# EAGLE design tokyo (EAGLE 7.6.0)
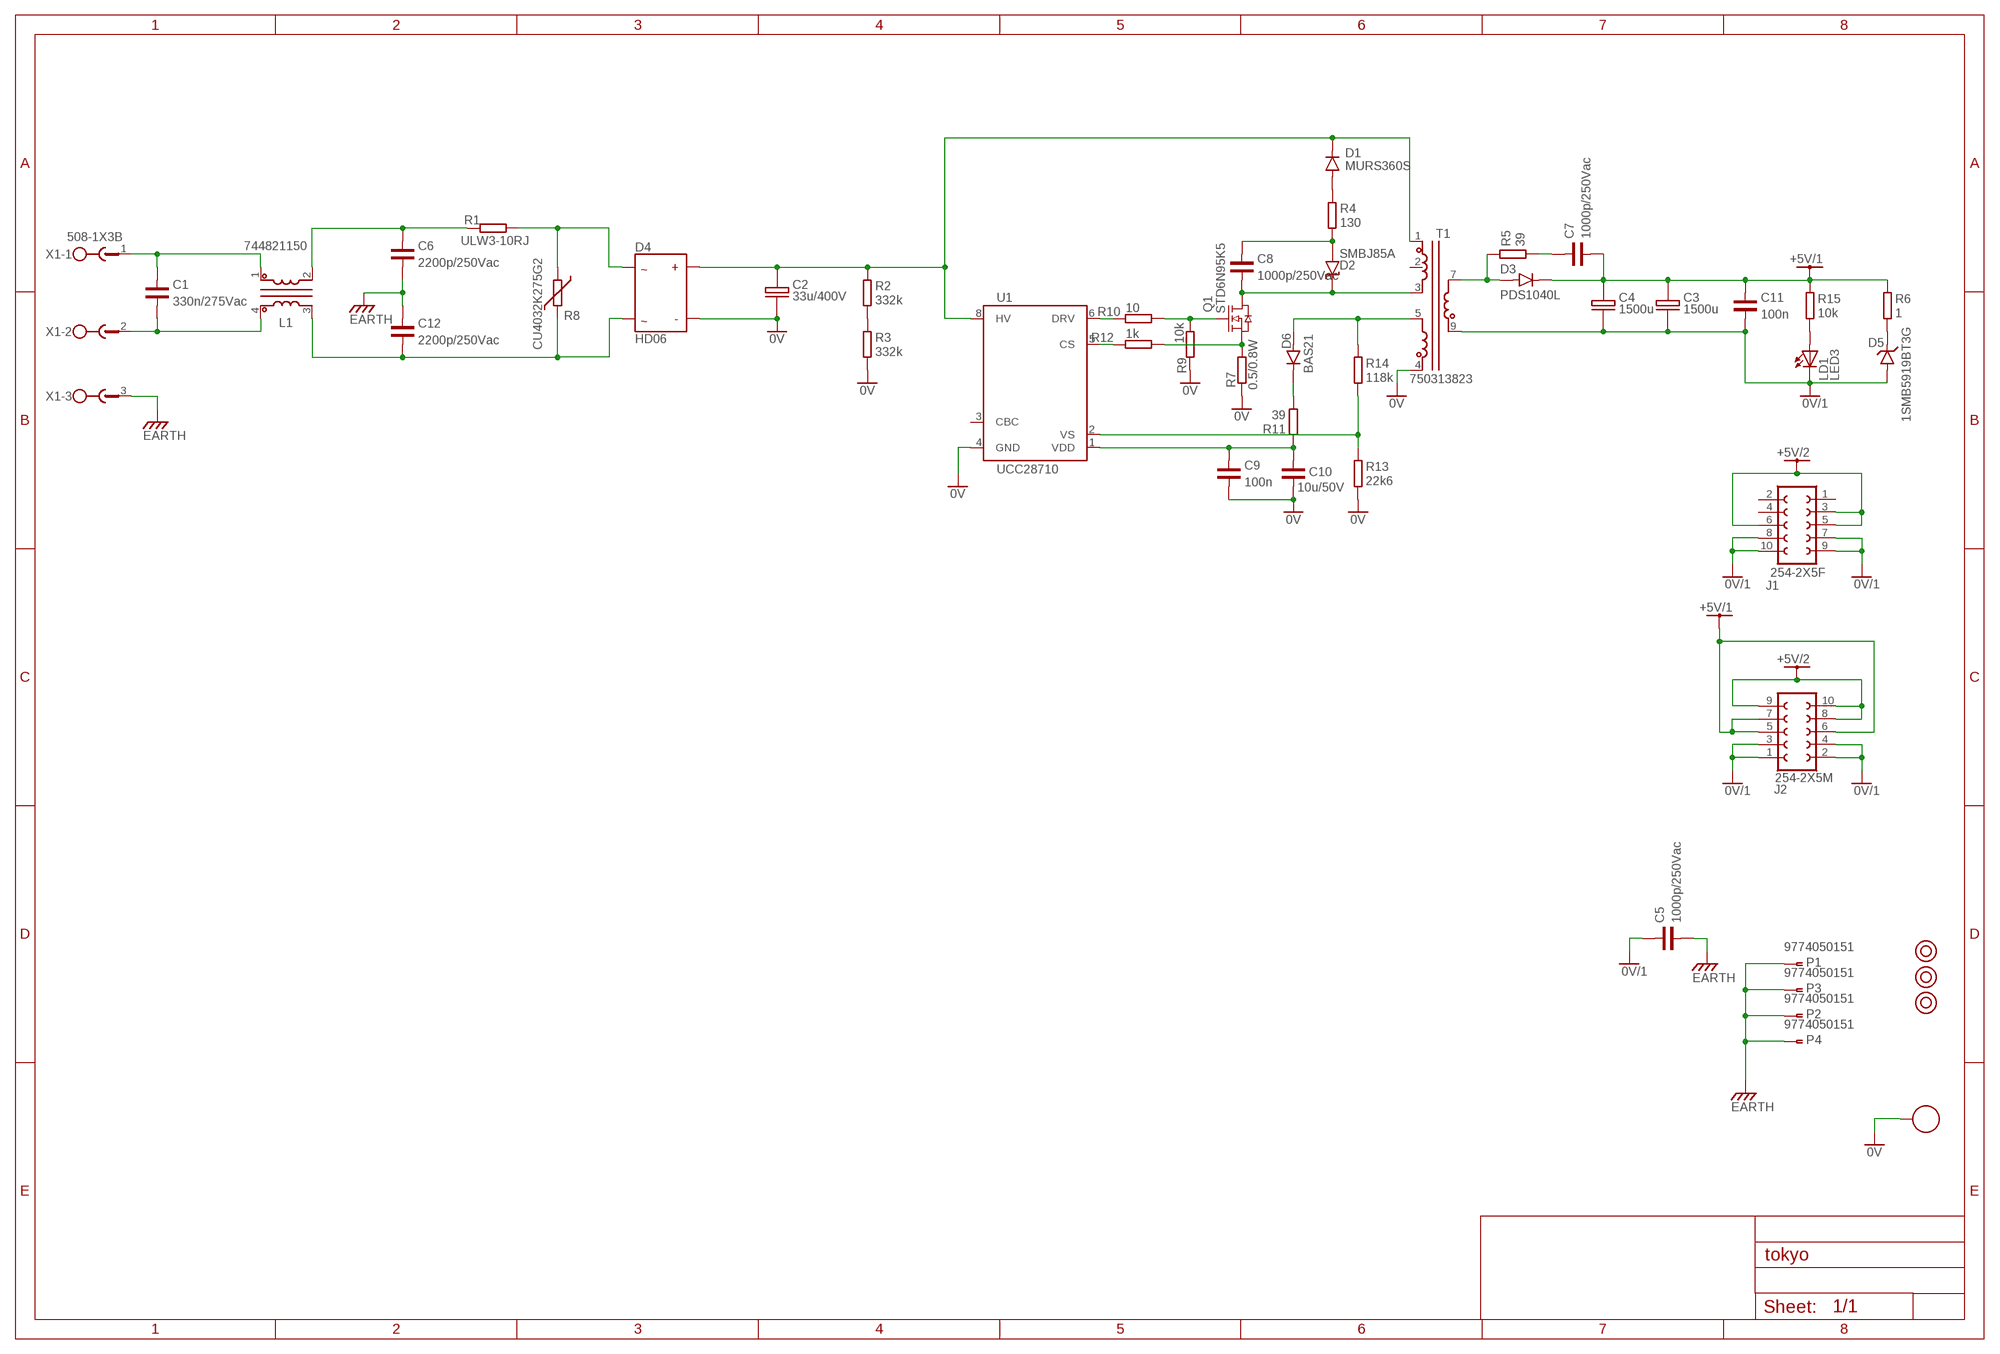
[diagram p0: schematic, sheet 1]

## Parts
0V  TESTPOINT  [TESTPOINT]
C1  330n/275Vac  C15X8.5  [15X8.5]
C2  33u/400V  C+D18  [D18]
C3  1500u  C+D10  [D10]
C4  1500u  C+D10  [D10]
C5  1000p/250Vac  C1812  [1812]
C6  2200p/250Vac  C2211  [2211]
C7  1000p/250Vac  C1812  [1812]
C8  1000p/250Vac  C1812  [1812]
C9  100n  C0603  [0603]
C10  10u/50V  C1206  [1206]
C11  100n  C0603  [0603]
C12  2200p/250Vac  C2211  [2211]
D1  MURS360S  [DO-214AA]
D2  SMBJ85A  [DO-214AA]
D3  PDS1040L  [POWERDI5]
D4  HD06  [MINIDIP]
D5  1SMB5919BT3G  [DO-214AA]
D6  BAS21  [SOT23]
FIDUCIAL1  FIDUCIAL  [FIDUCIAL]
FIDUCIAL2  FIDUCIAL  [FIDUCIAL]
FIDUCIAL3  FIDUCIAL  [FIDUCIAL]
J1  254-2X5F  [254-2X5F]
J2  254-2X5M  [254-2X5M]
L1  744821150  [744821150]
LD1  LED3  [LED3]
P1  9774050151  [9774050151]
P2  9774050151  [9774050151]
P3  9774050151  [9774050151]
P4  9774050151  [9774050151]
Q1  STD6N95K5  [DPAK]
R1  ULW3-10RJ  R15X6  [15X6]
R2  332k  R1206  [1206]
R3  332k  R1206  [1206]
R4  130  R1206  [1206]
R5  39  R1206  [1206]
R6  1  R1206  [1206]
R7  0.5/0.8W  R2512  [2512]
R8  CU4032K275G2  [4032]
R9  10k  R0603  [0603]
R10  10  R0603  [0603]
R11  39  R0603  [0603]
R12  1k  R0603  [0603]
R13  22k6  R0603  [0603]
R14  118k  R0603  [0603]
R15  10k  R0603  [0603]
T1  750313823  [EE16]
U1  UCC28710  [SOIC7]
X1  508-1X3B  [508-1X3B]

## Nets
0V: 0V.P$1 C2.2 C9.2 C10.2 D4.2 R3.2 R7.1 R9.1 R13.2 T1.4 U1.4(GND)
0V/1: C3.2 C4.2 C5.1 C11.2 D5.2 J1.7 J1.8 J1.9 J1.10 J2.1 J2.2 J2.3 J2.4 LD1.C T1.9
+5V/1: C3.1 C4.1 C7.2 C11.1 D3.3 J2.5 J2.6 J2.7 R6.1 R15.1
+5V/2: J1.3 J1.5 J1.6 J2.8 J2.9 J2.10
EARTH: C5.2 C6.1 C12.2 P1.P1 P2.P1 P3.P1 P4.P1 X1.3
N$1: C6.2 L1.2 R1.1
N$2: C12.1 D4.4 L1.3 R8.2
N$3: D6.1 R14.1 T1.5
N$4: D4.3 R1.P$2 R8.1
N$5: LD1.A R15.2
N$6: C7.1 R5.2
N$7: R2.2 R3.1
N$8: D3.1 D3.2 R5.1 T1.7
N$9: C2.1 D1.1 D4.1 R2.1 T1.1 U1.8(HV)
N$10: D1.2 R4.1
N$11: C8.2 D2.1(C) Q1.2(D) T1.3
N$12: Q1.3(S) R7.2 R12.2
N$13: R12.1 U1.5(CS)
N$14: Q1.1(G) R9.2 R10.2
N$15: C9.1 C10.1 R11.1 U1.1(VDD)
N$16: D5.1 R6.2
N$17: C8.1 D2.2(A) R4.2
N$18: R13.1 R14.2 U1.2(VS)
N$19: C1.1 L1.1 X1.1
N$22: C1.2 L1.4 X1.2
N$23: R10.1 U1.6(DRV)
N$26: D6.3 R11.2
Unconnected: J1.1 J1.2 J1.4 T1.2 U1.3(CBC)

## Library data of the parts
0V = unsorted:TESTPOINT: test point (black); MF: Kobiconn; MF#: 151-203-RC; MOUSER#: 151-203-RC
C1 C5-C12 = capacitors:C: capacitor
C2-C4 = capacitors:C+: polarized capacitor
D1 = diodes:MURS360S: 3 A 600 V ultrafast rectifier; MF: Vishay; MF#: MURS360S; MOUSER#: 625-MURS360S-E3
D2 = supressors:SMBJ85A: 85 V, 600 W transient voltage suppressor; MF: Bourns; MF#: SMBJ85A; MOUSER#: 652-SMBJ85A
D3 = diodes:PDS1040L: 2 A 40 V schottky rectifier; MF: Diodes Inc.; MF#: PDS1040L; MOUSER#: 621-PDS1040L-13
D4 = diodes:HD06: 600V, 0.8 A bridge rectifier; MF: Diodes Inc.; MF#: HD06-T; MOUSER#: 621-HD06T
D5 = diodes:1SMB5919BT3G: 5.6 V 3 W zener voltage regulator; MF: ON Semiconductor; MF#: 1SMB5919BT3G; MOUSER#: 863-1SMB5919BT3G
D6 = diodes:BAS21: 200 mA 250 V general purpose high voltage diode; MF: Fairchild; MF#: BAS21; MOUSER#: 512-BAS21
FIDUCIAL1-FIDUCIAL3 = unsorted:FIDUCIAL: fiducial mark
J1 = board-to-board:254-2X5F: 2.54 mm angled dual pin socket; MF: Würth Elektronik; MF#: 613 010 243 121
J2 = board-to-board:254-2X5M: 2.54 mm angled dual pin header; MF: Würth Elektronik; MF#: 613 010 210 21
L1 = powermagnetics:744821150: 5.0 mH 1.0 A power line choke; MF: Würth Elektronik; MF#: 744 821 150
LD1 = unsorted:LED3: 3 mm thru-hole led
P1-P4 = unsorted:9774050151: 5.0 mm steel spacer M2.5 internal thread; MF: Würth Elektronik; MF#: 977 405 015 1
Q1 = transistors:STD6N95K5: 950 V 9 A N-channel power mosfet; MF: ST Microelectronics; MF#: STD6N95K5; MOUSER#: 511-STD6N95K5
R1-R7 R9-R15 = resistors:R: resistor
R8 = supressors:CU4032K275G2
T1 = powermagnetics:750313823: 13 W flyback transformer; MF: Würth Elektronik; MF#: 750 313 823
U1 = integratedcircuits:UCC28710: flyback power supply controller; MF: Texas Instruments; MF#: UCC28710D; MOUSER#: 595-UCC28710D
X1 = board-to-wire:508-1X3B: 3-pole 5.08 mm pitch horizontal pcb header; MF: Würth Elektronik; MF#: 691 313 510 003

## Board
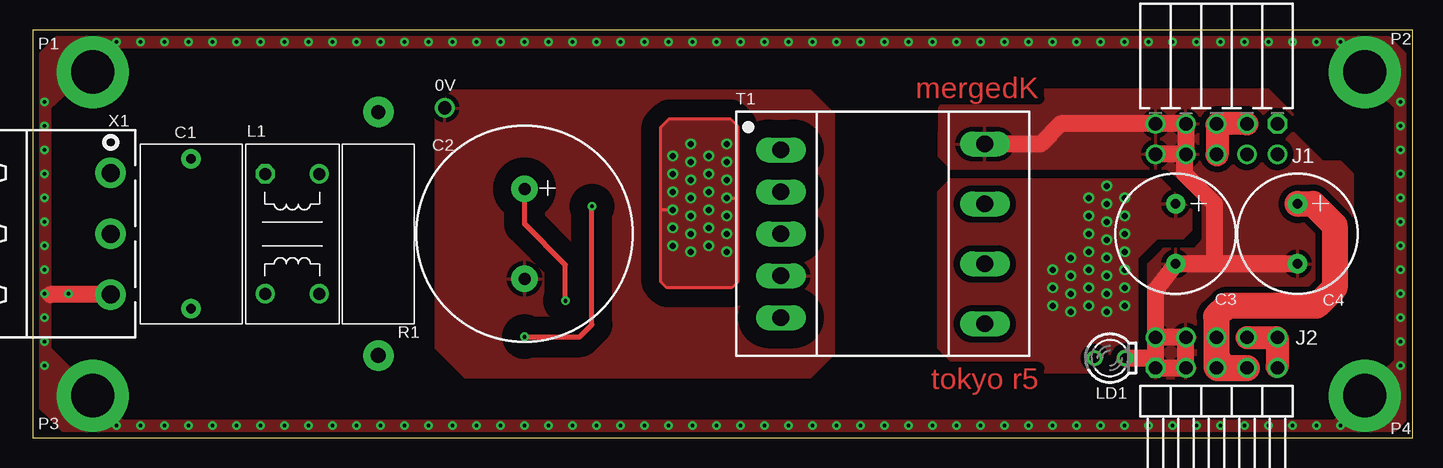
[diagram p1: board, top side]
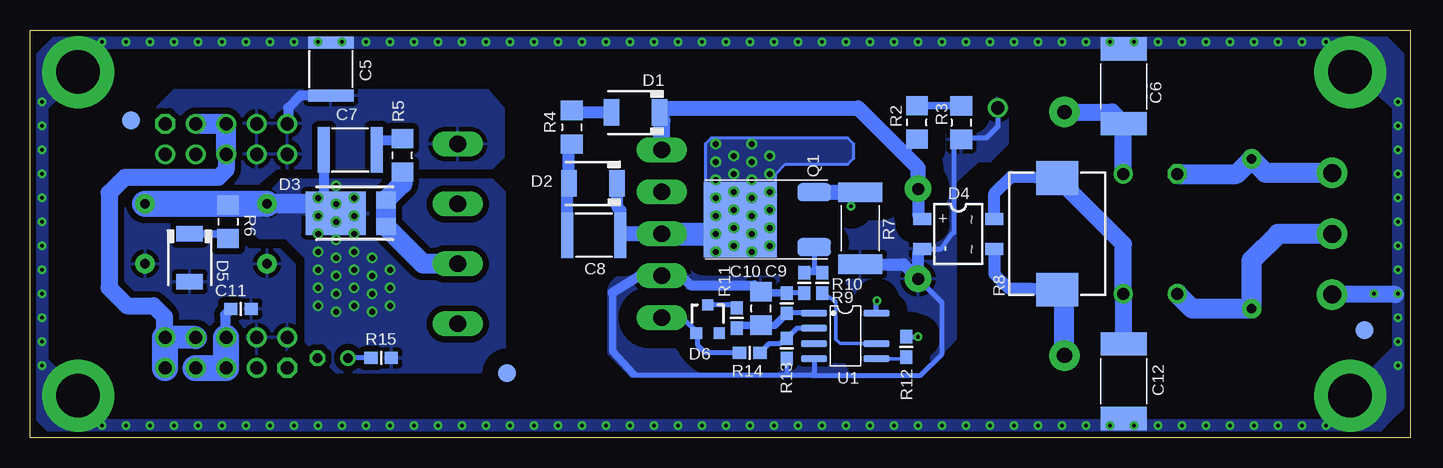
[diagram p2: board, bottom side, seen from below]

Size 115 x 34 mm. Coordinates in mm from the lower left corner, seen from the top.
Outline: 0,0 115,0 115,34 0,34 0,0
Copper layers (1*16): Top 0.035mm / dielectric 1.5mm / Bottom 0.035mm
Design rules "default *": minimum track width 10mil, minimum drill 10mil, track to track 8mil, track to pad 8mil, pad to pad 8mil, via to via 8mil, smd to smd 8mil, copper to edge 20mil, drill to drill 8mil, minimum pad ring 10mil, minimum via ring 8mil, stop-mask expansion 2mil, vias tented up to drill 0mil, thermal gap 15mil

### Footprints (pad centres in the part's own frame; a part is rotated, then mirrored left to right if it is on the bottom)
TESTPOINT = drill 1.1 pad 1.6: P$1 0,0
15X8.5 = drill 0.8 pad 1.6: 1 -6.25,0; 2 6.25,0
D18 = drill 1 pad 2.2: 1 0,3.75; 2 0,-3.75
D10 = drill 0.8 pad 1.6: 1 0,2.5; 2 0,-2.5
1812 = smd 1 x 3.8: 1 -2.2,0; 2 2.2,0
2211 = smd 1.93 x 3.81: 1 -3.12,0; 2 3.12,0
0603 = smd 1.1 x 1: 1 -0.85,0; 2 0.85,0
1206 = smd 1.6 x 1.8: 1 -1.4,0; 2 1.4,0
DO-214AA = smd 1.3 x 2.2: 1 -2,0; 2 2,0
POWERDI5 = smd 1.6 x 1.4: 1 -0.7,1.1; 2 -0.7,-1.1 | smd 5 x 3.6: 3 3.5,0
MINIDIP = smd 1 x 1.5: 1 1.25,3; 2 -1.25,3; 3 -1.25,-3; 4 1.25,-3
SOT23 = smd 1 x 0.95: 1 -0.95,-1.175 | smd 0.9 x 0.95: 2 0.95,-1.175; 3 0,1.175
FIDUCIAL = smd 1.5 x 1.5: P1 0,0
254-2X5F = drill 1.1 pad 1.6 octagon: 1 -5.08,-1.27 | drill 1.1 pad 1.6: 2 -5.08,1.27; 3 -2.54,-1.27; 4 -2.54,1.27; 5 0,-1.27; 6 0,1.27; 7 2.54,-1.27; 8 2.54,1.27; 9 5.08,-1.27; 10 5.08,1.27
254-2X5M = drill 1.1 pad 1.6 octagon: 1 -5.08,-1.27 | drill 1.1 pad 1.6: 2 -5.08,1.27; 3 -2.54,-1.27; 4 -2.54,1.27; 5 0,-1.27; 6 0,1.27; 7 2.54,-1.27; 8 2.54,1.27; 9 5.08,-1.27; 10 5.08,1.27
744821150 = drill 1 pad 1.6 octagon: 1 5,2.25 | drill 1 pad 1.6: 2 5,-2.25; 3 -5,-2.25; 4 -5,2.25
LED3 = drill 0.8: A -1.27,0 | drill 0.8 octagon: C 1.27,0
9774050151 = drill 3.6 pad 6: P1 0,0
DPAK = smd 2.8 x 1.5: 1 -3.95,2.286; 3 -3.95,-2.286 | smd 6.1 x 6.3: 2 2.2,0
15X6 = drill 1.2 pad 2.54: 1 -10.15,0 | drill 1.27 pad 2.54: P$2 10.15,0
2512 = smd 1.65 x 3.68: 1 -3,0; 2 3,0
4032 = smd 2.8 x 3.5: 1 -4.65,0; 2 4.65,0
EE16 = drill 1.4 pad 2 long: 1 -8.5,7; 2 -8.5,3.5; 3 -8.5,0; 4 -8.5,-3.5; 5 -8.5,-7; 6 8.5,-7.5; 7 8.5,-2.5; 8 8.5,2.5; 9 8.5,7.5
SOIC7 = smd 2.2 x 0.6: 1 -2.6,1.905; 2 -2.6,0.635; 3 -2.6,-0.635; 4 -2.6,-1.905; 5 2.6,-1.905; 6 2.6,-0.635; 8 2.6,1.905
508-1X3B = drill 1.5 pad 2.54: 1 0,5.08; 2 0,0; 3 0,-5.08

### Placement (x,y rotation side)
0V  34.35,27.5 0 top
C1  13.2,17 270 top
C2  41,17 0 top
C3  95.25,17 0 top
C4  105.41,17 0 top
C5  89.93,30.74 90 bottom
C6  23.85,29.3 270 bottom
C7  88.31,24 180 bottom
C8  68.01,16.88 0 bottom
C9  51.95,11.2 90 bottom
C10  54.09,10.77 90 bottom
C11  97.42,10.74 0 bottom
C12  23.85,4.7 270 bottom
D1  64.55,27.11 180 bottom
D2  68.1,21.2 180 bottom
D3  86.04,18.71 180 bottom
D4  37.63,17 90 bottom
D5  101.7,15 270 bottom
D6  58.52,9.89 0 bottom
FIDUCIAL1  106.6,26.47 0 bottom
FIDUCIAL2  3.79,8.97 0 bottom
FIDUCIAL3  75.23,5.37 0 bottom
J1  98.65,24.9 180 top
J2  98.65,7.08 0 top
L1  21.64,17 90 top
LD1  89.77,6.64 0 top
P1  5,30.5 0 top
P2  111,30.5 0 top
P3  5,3.5 0 top
P4  111,3.5 0 top
Q1  53.61,18.18 180 bottom
R1  28.8,17 270 top
R2  41.1,26.29 90 bottom
R3  37.4,26.27 270 bottom
R4  69.86,25.89 270 bottom
R5  83.97,23.54 90 bottom
R6  98.5,18 270 bottom
R7  45.8,17.45 90 bottom
R8  29.4,17 90 bottom
R9  50.5,12.9 90 bottom
R10  49,12.9 90 bottom
R11  56.1,9.97 90 bottom
R12  41.97,7.56 90 bottom
R13  51.93,7.43 270 bottom
R14  55.02,7.07 0 bottom
R15  85.74,6.63 180 bottom
T1  70.85,17 0 top
U1  47.06,8.48 0 bottom
X1  6.5,17 0 top

### Tracks (layer width: path | path; a pad name or v marks a point on that pad's centre or on a via)
0V
  Bottom 0.305: 51.65,12.05 C9.2
  Bottom 0.406: R9.1 51.65,12.05 | 49.85,5.2 51.85,5.2 | 51.85,5.2 64.45,5.2 64.75,5.3 | U1.4 49.66,5.39 49.85,5.2 | R13.2 51.93,5.22 51.85,5.2 | 49.85,5.2 40.8,5.2 39,7 39,11.25 C2.2 | D4.2 39.07,15.73 38.1,17.1 38,17.1 38,24.27 R3.2 37.27,25 35.3,25 34.35,25.95 0V.P$1
  Bottom 0.61: 66.45,12.1 66.45,7.2 64.75,5.3 | 60.75,13.5 T1.4 64.25,13.5 | 54.62,12.7 C10.2 | 53.91,12.35 C10.2 | C9.2 53.97,12.05 C10.2
  Bottom 0.813: 64.25,13.5 66.45,12.1 | 60.75,13.5 59.95,12.7 54.62,12.7
  Bottom 1.016: D4.2 41,15.36 C2.2 42.2,14.46 R7.1
  pour Top (isolate 1.5): 33.5,7.5 36,5 64.85,5 66.85,7 66.85,27 64.85,29 35,29 33.5,27.5
  pour Bottom (isolate 1.5): 38.5,7.5 40.9,5 64.85,5 66.85,7 66.85,27 64.85,29 35,29 33.5,27.5 33.5,24.5 35,23 36,23 37.8,21.3 37.8,8.2
0V/1
  Top 0.406: 92.74,6.64 J2.1
  Top 1.422: LD1.C 92.74,6.64 | J2.2 J2.1 J2.3 J2.4 J2.2 | J2.2 93.57,12.33 C3.2 | C4.2 C3.2 | C3.2 98.49,14.51 98.5,14.8 98.5,19.5 96,22 96,23.52 J1.8 | J1.8 J1.10 | J1.8 J1.7 J1.9 85.67,26.17 84,24.5 T1.9
  Bottom 0.813: C5.1 92.46,28.54 93.5,27.5 93.5,26.24 J1.9
  pour Top (isolate 0.508): 92.95,7.4 93.35,5 104.5,5 105,5.5 105,9 106,10 109.5,10 110,10.5 110,22 109,23 107.5,23 105,25.5 105,27 103,29 76.85,29 75.55,27.5 75.5,23.5 76.5,22.5 94.5,22.5 97.5,20 97.5,16.5 96.8,15.7 94.2,15.7 92.95,14.45
  pour Bottom (isolate 0.508): 96.35,7 98.35,5 104.5,5 105,5.5 105,9 106,10 109.5,10 110,10.5 110,22 109,23 107.5,23 105,25.5 105,27 103,29 76.85,29 75.55,27.5 75.55,23.45 76.5,22.5 94.5,22.5 97.5,20 97.5,16.5 96.8,15.7 94.2,15.7 93,14.5 93,8 94,7
+5V/1  (via drill 0.5)
  Top 1.676: 98.6,8.6 J2.6
  Top 2.184: C4.1 106.69,19.51 108.5,17.7 108.5,12.5 107,11 99.5,11 98.6,10.1 98.65,10.1 98.65,5.87 98.81,6.5 98.73,5.8 J2.7
  Bottom 0.406: C11.1 | 98.75,8.45 J2.6 | R6.1 95.35,19.4 C3.1
  Bottom 0.813: C7.2 90.52,19.69 D3.3 | C11.1 98.75,10.25 98.75,8.45
  Bottom 1.676: D3.3 90.15,19.51 C3.1
  Bottom 2.184: J2.7 J2.5 J2.6 | C3.1 C4.1
  other vias: 86.5,12 88,20 88,18.5 88,17 89.5,19.5 91,20 91,18.5 89.5,18 91,17 89.5,16.5 89.5,15 91,15.5 88,15.5 88,14 89.5,13.5 91,14 91,12.5 88,12.5 89.5,12 86.5,15 86.5,13.5 85,14 85,12.5 85,11 88,11 91,11 86.5,10.5 89.5,10.5 89.5,21
  pour Bottom (isolate 0.508): 76.5,21.5 94,21.5 96.5,19 96.5,17.3 95.9,16.7 93.7,16.7 92,15 92,8 89.5,5.5 77.5,5.5 75.5,7.5 75.5,20.5
  pour Top (isolate 0.508): 76.5,21.5 94,21.5 96.5,19 96.5,17.3 95.9,16.7 93.7,16.7 92,15 92,8 89.5,5.5 77.5,5.5 75.5,7.5 75.5,20.5
+5V/2
  Top 1.93: J2.8 103.65,8.35 103.7,8.3 103.7,5.9 | J1.3 98.77,26.17 98.7,26.1 98.7,23.6
  Bottom 1.422: J1.6 98.65,22.35 99.3,21.7 107.1,21.7 108.4,20.4 108.4,12.5 106.9,11 104.7,11 103.8,10.1 103.8,8.42 J2.10
  Bottom 1.676: J1.6 J1.5 J1.3
  Bottom 1.93: J2.8 J2.10
  Bottom 2.184: J2.9 J2.10
EARTH  (via drill 0.3)
  Top 1.422: X1.3 1.5,11.92
  Bottom 0.406: 1.08,11.92 v1,12
  Bottom 0.508: v3,12 1.2,11.92
  Bottom 1.016: 6.42,11.92 6.5,12
  Bottom 1.422: 1.2,11.92 6.42,11.92
  other vias: 7,1 9,1 11,1 13,1 15,1 17,1 19,1 21,1 23,1 25,1 27,1 29,1 31,1 33,1 35,1 37,1 39,1 41,1 43,1 45,1 47,1 49,1 51,1 53,1 55,1 57,1 59,1 61,1 63,1 65,1 67,1 69,1 71,1 73,1 75,1 81,1 83,1 77,1 79,1 89,1 91,1 93,1 95,1 97,1 99,1 101,1 103,1 105,1 107,1 109,1 114,6 114,8 114,10 114,12 114,14 114,16 114,18 114,20 114,22 114,24 114,26 114,28 109,33 107,33 105,33 103,33 101,33 99,33 97,33 95,33 93,33 91,33 89,33 87,33 85,33 83,33 81,33 79,33 77,33 75,33 73,33 71,33 69,33 67,33 65,33 63,33 61,33 59,33 57,33 55,33 53,33 51,33 49,33 47,33 45,33 43,33 41,33 39,33 37,33 35,33 33,33 31,33 29,33 27,33 25,33 23,33 21,33 19,33 17,33 15,33 13,33 11,33 9,33 7,33 1,28 1,26 1,24 1,22 1,20 1,18 1,16 1,14 1,10 1,8 1,6 85,1 87,1
  pour Bottom (no thermals): 5,4 7.5,1.5 108.5,1.5 113.5,6.5 113.5,27.5 108.5,32.5 7,32.5 1.5,27.5 1.5,7.5 4.95,4.05 1.95,1.05 0,3 0,31.5 2.5,34 112.5,34 115,31.5 115,2 113,0 3,0 2,1
  pour Top (no thermals): 5,4 7.5,1.5 108.5,1.5 113.5,6.5 113.5,27.5 108.5,32.5 7,32.5 1.5,27.5 1.5,7.5 4.95,4.05 1.95,1.05 0,3 0,31.5 2.5,34 112.5,34 115,31.5 115,2 113,0 3,0 2,1
N$1
  Bottom 1.422: L1.2 23.89,26.14 C6.2 24.82,27.15 R1.1
N$2
  Bottom 1.016: D4.4 34.63,20.37 33.25,21.75 R8.2
  Bottom 1.422: C12.1 23.85,11.96 L1.3 23.89,16.14 R8.2
N$3
  Bottom 0.406: R14.1 58.72,7.07 59.35,7.7 59.35,8.7 D6.1 59.37,8.72 60.55,9.9 62.25,9.9 T1.5
N$4
  Bottom 1.016: R8.1 33.45,12.45 34.63,13.63 D4.3
  Bottom 1.676: R1.P$2 28.8,11.85 R8.1
N$5
  Bottom 0.406: R15.2 LD1.A
N$6
  Bottom 0.813: C7.1 86.11,24.79 86.1,24.8 84.11,24.8 R5.2
N$7
  Bottom 0.61: R2.2 37.41,27.68 R3.1
N$8
  Bottom 1.676: T1.7 82.23,14.5 D3.1 D3.2 83.97,21.17 R5.1
N$9  (via drill 0.3)
  Top 0.406: v44.4,11.4 44.4,14.4 41,17.8 C2.1
  Bottom 0.406: U1.8 44.46,11.34 v44.4,11.4
  Bottom 0.61: R2.1 41.12,24.89 42.25,23.75
  Bottom 1.016: 62.35,26.41 D1.1 | 41,22 C2.1 41,18.6 D4.1
  Bottom 1.27: 62.35,26.41 62.35,27.15 62,27.5 46,27.5 42.25,23.75 41,22.5 C2.1
  Bottom 1.422: T1.1 62.35,26.41
N$10
  Bottom 1.016: D1.2 69.67,27.11 R4.1
N$11  (via drill 0.5)
  Top 0.254: 58.75,19.9 58.75,26 58.15,26.6 53.05,26.6 52.35,25.9 52.35,19 | 58.75,19.9 58.75,13 58.25,12.5 52.85,12.5 52.35,13 52.35,19 | v53.35,19 52.35,19 | v57.85,20 58.65,20 58.75,19.9
  Bottom 0.254: Q1.2 55.67,17.18 53.35,19.5 | 52.85,20.2 52.85,22 52.05,22.8 46.85,22.8 46.35,23.3 46.35,24.5 46.85,25 58.25,25 58.75,24.5 58.75,20.4 58.25,19.9 53.05,19.9 52.85,20.2 | v53.35,19 53.35,19.5 | 53.35,19.5 52.85,20.2
  Bottom 1.016: 65.69,17 C8.2 65.81,18.96 66.05,19.2 66.05,20.45 D2.1
  Bottom 1.27: T1.3 65.69,17 | 55.89,17 Q1.2
  Bottom 1.93: T1.3 55.89,17
  other vias: 57.85,18.5 57.85,17 57.85,15.5 56.35,20.5 56.35,16 56.35,17.5 56.35,19 54.85,20 54.85,18.5 54.85,17 54.85,15.5 53.35,20.5 53.35,16 53.35,17.5 54.85,21.5 56.35,22 57.85,21.5 57.85,23 57.85,24.5 56.35,23.5 54.85,23 54.85,24.5 53.35,22 53.35,23.5
  pour Bottom (no thermals): 52.85,20.2 52.85,22 52.05,22.8 46.85,22.8 46.35,23.3 46.35,24.5 46.85,25 58.25,25 58.75,24.5 58.75,20.4 58.25,19.9 52.95,19.9
  pour Top (no thermals): 52.35,13 52.35,25.9 53.05,26.6 58.15,26.6 58.75,26 58.75,13 58.25,12.5 52.85,12.5
N$12  (via drill 0.3 pad 0.55)
  Top 0.406: v41,8.4 45.6,8.4 46.6,9.4 v46.6,19.3
  Bottom 0.406: R12.2 v41.01,8.41 v41,8.4 | v46.6,19.3 46.6,20.07 47,20.47
  Bottom 1.27: Q1.3 47,20.47 45.81,20.47 R7.2
N$13
  Bottom 0.305: U1.5 41.91,6.58 R12.1
N$14
  Bottom 0.305: 49.66,14.14 R9.2
  Bottom 0.406: R10.2 R9.2 | Q1.1 49.66,14.14
N$15
  Bottom 0.305: 51.69,10.38 C9.1
  Bottom 0.406: U1.1 51.69,10.38
  Bottom 0.61: R11.1 55.85,9.37 C10.1 52.93,9.37 C9.1
N$16
  Bottom 0.406: 99.4,17 R6.2
  Bottom 0.61: D5.1 99.4,17
N$17
  Bottom 1.016: R4.2 70.1,24.25 D2.2 70.21,20.39 C8.1
N$18
  Bottom 0.406: U1.2 51.09,9.12 R13.1 52.05,8.28 52.51,7.82 53.42,7.82 R14.2
N$19
  Bottom 1.676: X1.1 12.03,22.08 C1.1 14.45,22 L1.1
N$22
  Bottom 1.676: X1.2 11,17 13.2,14.8 C1.2 18.14,10.75 L1.4
N$23
  Bottom 0.305: U1.6 47.49,7.84 47.85,8.2 47.85,11.35 R10.1
N$24
  cutout Bottom: 64.85,13.6 65.45,13.6 arc-90 66.95,12 67.15,12 67.15,12.2 arc90 65.15,13.9 arc90
N$26
  Bottom 0.406: R11.2 56.62,11.07 D6.3

### Text on the board
Top: mergedK | tokyo r5
tStop: mergedK | tokyo r5